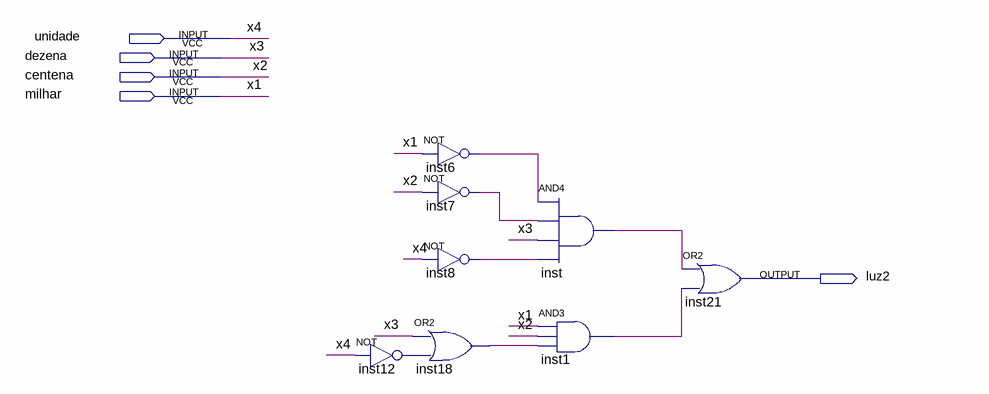
[diagram p0: schematic sheet]
// Quartus schematic luz2.bdf as structural Verilog: 8 symbols, 5 pins
module luz2 (
  input  unidade,
  input  dezena,
  input  centena,
  input  milhar,
  output luz2
);

  wire inst1_out, inst6_out, inst7_out, inst8_out, inst12_out, inst18_out, inst_out;

  or inst18 (inst18_out, dezena, inst12_out);
  not inst12 (inst12_out, unidade);
  not inst6 (inst6_out, milhar);
  not inst7 (inst7_out, centena);
  not inst8 (inst8_out, unidade);
  and inst (inst_out, inst6_out, inst7_out, dezena, inst8_out);
  and inst1 (inst1_out, milhar, centena, inst18_out);
  or inst21 (luz2, inst_out, inst1_out);

  // Other names for the same wires on the sheet: x1 = milhar; x2 = centena; x3 = dezena; x4 = unidade
endmodule
